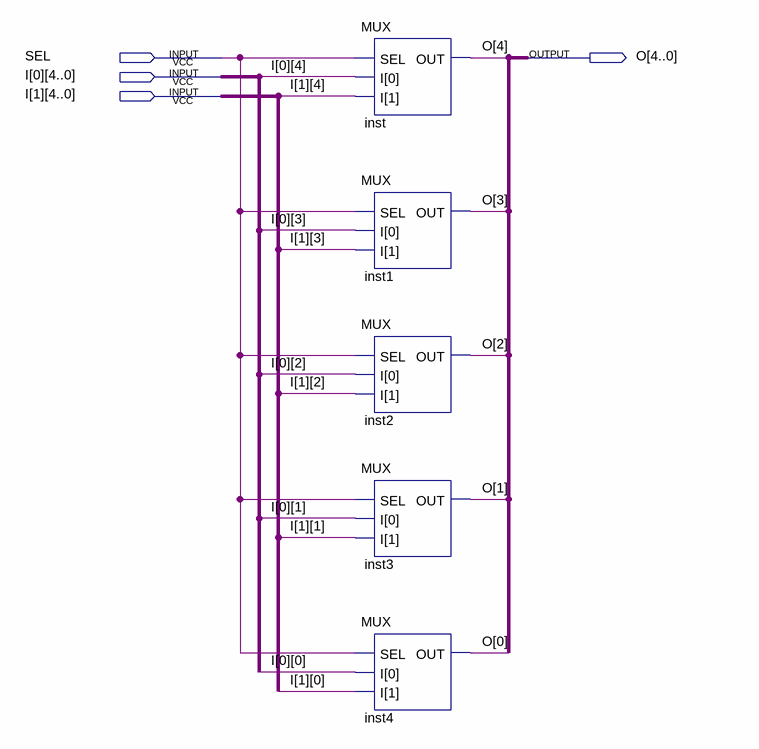
[diagram p0: schematic sheet]
// Quartus schematic SELECTOR.bdf as structural Verilog: 5 symbols, 4 pins
module SELECTOR (
  input  SEL,
  input  [4:0] I_0,
  input  [4:0] I_1,
  output [4:0] O
);

  MUX inst (.SEL(SEL), .I({I_1[4], I_0[4]}), .OUT(O[4]));
  MUX inst1 (.SEL(SEL), .I({I_1[3], I_0[3]}), .OUT(O[3]));
  MUX inst2 (.SEL(SEL), .I({I_1[2], I_0[2]}), .OUT(O[2]));
  MUX inst3 (.SEL(SEL), .I({I_1[1], I_0[1]}), .OUT(O[1]));
  MUX inst4 (.SEL(SEL), .I({I_1[0], I_0[0]}), .OUT(O[0]));
endmodule
